# EAGLE design uLI-02 (EAGLE 7.2.0)
AUTHOR: M. Petrilak; VERSION: 00
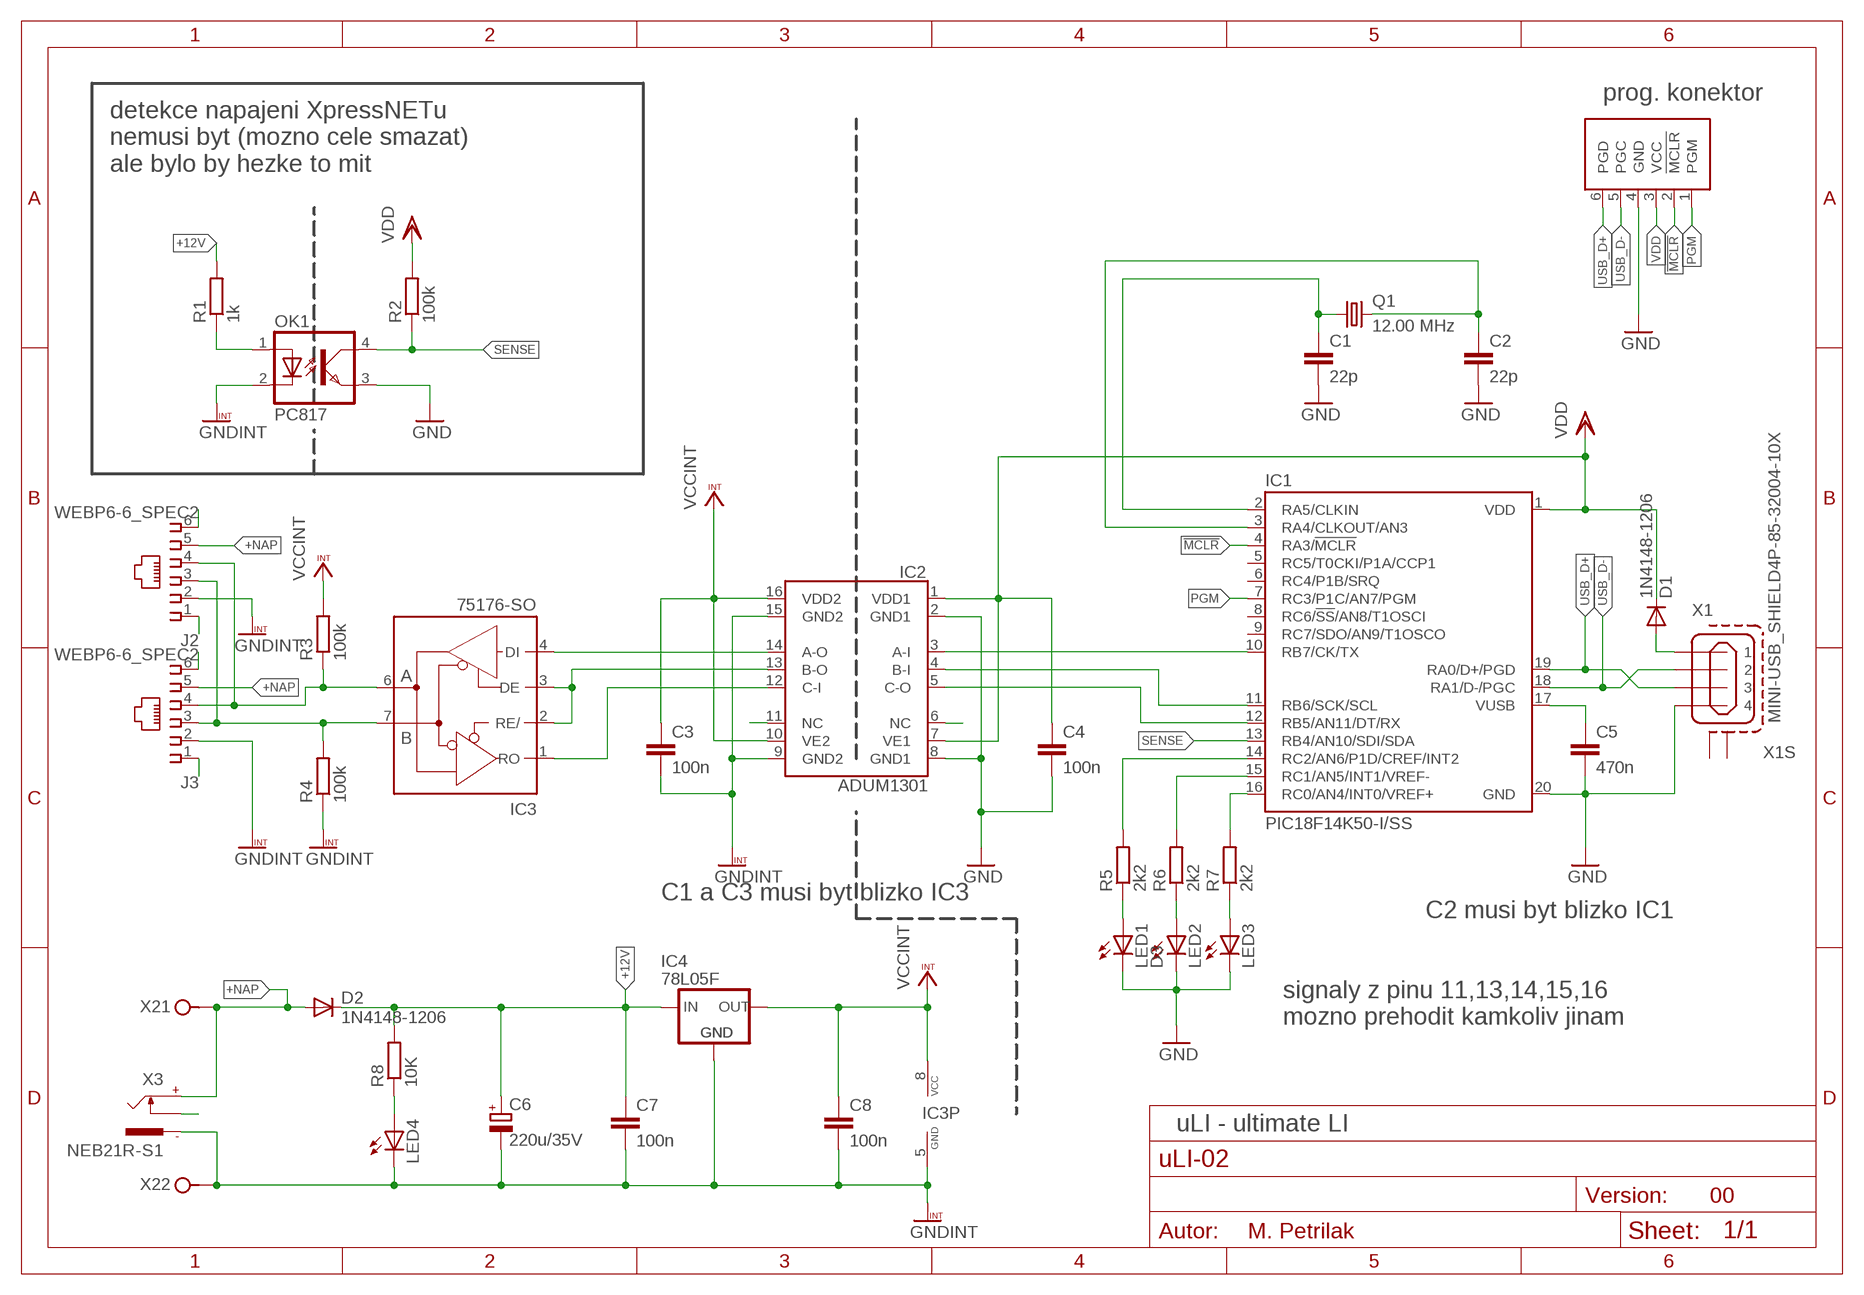
[diagram p0: schematic, sheet 1]

## Parts
C1  22p  C-EUC0805  [C0805]
C2  22p  C-EUC0805  [C0805]
C3  100n  C-EUC1206  [C1206]
C4  100n  C-EUC1206  [C1206]
C5  470n  C-EUC1206  [C1206]
C6  220u/35V  CPOL-EUE3.5-8L  [E3,5-8L]
C7  100n  C-EUC1206  [C1206]
C8  100n  C-EUC1206  [C1206]
D1  1N4148-1206  [D1206]
D2  1N4148-1206  [D1206]
IC1  PIC18F14K50-I/SS  [SSOP20]
IC2  ADUM1301  [SO-16W]
IC3  75176-SO  [SO08]
IC4  78L05F  [SOT89]
J1  PICPROG2-V  [6410-06-PICPROG]
J2  WEBP6-6_SPEC2  [WEBP6-6_SPEC2]
J3  WEBP6-6_SPEC2  [WEBP6-6_SPEC2]
LED1  D3  LED3MM  [LED3MM]
LED2  LED3MM  [LED3MM]
LED3  LED3MM  [LED3MM]
LED4  LED3MM  [LED3MM]
OK1  PC817  [DIL04]
Q1  12.00 MHz  XTAL  [HC49U70]
R1  1k  R-EU_R1206  [R1206]
R2  100k  R-EU_R1206  [R1206]
R3  100k  R-EU_R1206  [R1206]
R4  100k  R-EU_R1206  [R1206]
R5  2k2  R-EU_R1206  [R1206]
R6  2k2  R-EU_R1206  [R1206]
R7  2k2  R-EU_R1206  [R1206]
R8  10K  R-EU_R1206  [R1206]
X1  MINI-USB_SHIELD4P-85-32004-10X  [85-32004-10X]
X2  ARK1550/2_S  [ARK1550/2_SPEC]
X3  NEB21R-S1  [NEB21R_SPEC]

## Nets
!MCLR: IC1.4(RA3/!MCLR!) J1.2(!MCLR)
+12V [BUS]: C6.+ C7.1 D2.C IC4.3(VI) R1.2 R8.2
+NAP [BUS]: D2.A J2.5 J3.5 X2.1 X3.+
BUS_A [BUS]: IC3.6(A) J2.4 J3.4 R3.1
BUS_B [BUS]: IC3.7(B) J2.3 J3.3 R4.2
BUS_RX [BUS]: IC2.12(C-I) IC3.1(RO)
BUS_SENSE [BUS]: OK1.1(A) R1.1
BUS_TE [BUS]: IC2.13(B-O) IC3.2(RE/) IC3.3(DE)
BUS_TX [BUS]: IC2.14(A-O) IC3.4(DI)
GND: C1.2 C2.2 C4.2 C5.2 IC1.20(GND) IC2.2(GND1) IC2.8(GND1) J1.4(GND) LED1.K(C) LED2.K(C) LED3.K(C) OK1.3(EMIT) X1.4
GNDINT [BUS]: C3.2 C6.- C7.2 C8.2 IC2.9(GND2) IC2.15(GND2) IC3.5(GND) IC4.2(GND) IC4.2@1(GND) J2.2 J3.2 LED4.K(C) OK1.2(C) R4.1 X2.2 X3.-
LED1: IC1.14(RC2/AN6/P1D/CREF/INT2) R5.2
LED1_R: LED1.A R5.1
LED2: IC1.15(RC1/AN5/INT1/VREF-) R6.2
LED2_R: LED2.A R6.1
LED3: IC1.16(RC0/AN4/INT0/VREF+) R7.2
LED3_R: LED3.A R7.1
N$1 [BUS]: LED4.A R8.1
N$10: D1.A X1.1
N$19 [BUS]: J2.6
N$20 [BUS]: J2.1
N$24 [BUS]: J3.6
N$25 [BUS]: J3.1
NC1 [BUS]: X3.C
NC2 [BUS]: IC2.11(NC)
NC3: IC2.6(NC)
PGM: IC1.7(RC3/P1C/AN7/PGM) J1.1(PGM)
PROC_RX: IC1.12(RB5/AN11/DT/RX) IC2.5(C-O)
PROC_TE: IC1.11(RB6/SCK/SCL) IC2.4(B-I)
PROC_TX: IC1.10(RB7/CK/TX) IC2.3(A-I)
SENSE: IC1.13(RB4/AN10/SDI/SDA) OK1.4(COL) R2.1
USB_D+: IC1.19(RA0/D+/PGD) J1.6(PGD) X1.3
USB_D-: IC1.18(RA1/D-/PGC) J1.5(PGC) X1.2
VBUS: C5.1 IC1.17(VUSB)
VCCINT [BUS]: C3.1 C8.1 IC2.10(VE2) IC2.16(VDD2) IC3.8(VCC) IC4.1(VO) R3.2
VDD: C4.1 D1.C IC1.1(VDD) IC2.1(VDD1) IC2.7(VE1) J1.3(VCC) R2.2
XTAL1: C1.1 IC1.2(RA5/CLKIN) Q1.1
XTAL2: C2.1 IC1.3(RA4/CLKOUT/AN3) Q1.2
Unconnected: IC1.5(RC5/T0CKI/P1A/CCP1) IC1.6(RC4/P1B/SRQ) IC1.8(RC6/!SS!/AN8/T1OSCI) IC1.9(RC7/SDO/AN9/T1OSCO) X1.M1(S1) X1.M2(S2)

## Notes on the sheet
- prog. konektor
- detekce napajeni XpressNETu
  nemusi byt (mozno cele smazat)
  ale bylo by hezke to mit
- C1 a C3 musi byt blizko IC3
- C2 musi byt blizko IC1
- signaly z pinu 11,13,14,15,16
  mozno prehodit kamkoliv jinam
- uLI - ultimate LI

## Library data of the parts
C1-C5 C7 C8 = rcl:C-EU: CAPACITOR, European symbol
C6 = rcl:CPOL-EU: POLARIZED CAPACITOR, European symbol
D1 D2 = diode:1N4148: DIODE high speed (Philips)
IC1 = microchip:PIC18*K50: PIC with USB
IC2 = my:ADUM1301
IC3 = maxim:75176
IC4 = linear:78L*: POSITOIV-VOLTAGE REGULATORS Output up to 100 mA Source: http://focus.ti.com/lit/ds/symlink/ua78l05.pdf
J1 = con-molex:PICPROG2
J2 J3 = con-malina:WEBP6-6
LED1-LED4 = led:LED: LED OSRAM: - CHIPLED LG R971, LG N971, LY N971, LG Q971, LY Q971, LO R971, LY R971 LH N974, LH R974 LS Q976, LO Q976, LY Q976 LO Q996 - Hyper CHIPLED LW Q18S LB Q993, LB Q99A, LB R99A - SideLED LS A670, LO A670, LY A670, LG A670, LP A670 LB A673, LV A673, LT A673, LW A673 LH A674 LY A675 LS A676, LA A676, LO A676, LY A676, LW A676 LS A679, LY A679, LG A679 - Hyper Micro SIDELED® LS Y876, LA Y876, LO Y876, LY Y876 LT Y87S - SmartLED LW L88C, LW L88S LB L89C, LB L89S, LG L890 LS L89K, LO L89K, LY L89K LS L896, LA L896, LO L896, LY L896 - TOPLED LS T670, LO T670, LY T670, LG T670, LP T670 LSG T670, LSP T670, LSY T670, LOP T670, LYG T670 LG T671, LOG T671, LSG T671 LB T673, LV T673, LT T673, LW T673 LH T674 LS T676, LA T676, LO T676, LY T676, LB T676, LH T676, LSB T676, LW T676 LB T67C, LV T67C, LT T67C, LS T67K, LO T67K, LY T67K, LW E67C LS E67B, LA E67B, LO E67B, LY E67B, LB E67C, LV E67C, LT E67C LW T67C LS T679, LY T679, LG T679 LS T770, LO T770, LY T770, LG T770, LP T770 LB T773, LV T773, LT T773, LW T773 LH T774 LS E675, LA E675, LY E675, LS T675 LS T776, LA T776, LO T776, LY T776, LB T776 LHGB T686 LT T68C, LB T68C - Hyper Mini TOPLED® LB M676 - Mini TOPLED Santana® LG M470 LS M47K, LO M47K, LY M47K Source: http://www.osram.convergy.de LUXEON: - LUMILED® LXK2-PW12-R00, LXK2-PW12-S00, LXK2-PW14-U00, LXK2-PW14-V00 LXK2-PM12-R00, LXK2-PM12-S00, LXK2-PM14-U00 LXK2-PE12-Q00, LXK2-PE12-R00, LXK2-PE12-S00, LXK2-PE14-T00, LXK2-PE14-U00 LXK2-PB12-K00, LXK2-PB12-L00, LXK2-PB12-M00, LXK2-PB14-N00, LXK2-PB14-P00, LXK2-PB14-Q00 LXK2-PR12-L00, LXK2-PR12-M00, LXK2-PR14-Q00, LXK2-PR14-R00 LXK2-PD12-Q00, LXK2-PD12-R00, LXK2-PD12-S00 LXK2-PH12-R00, LXK2-PH12-S00 LXK2-PL12-P00, LXK2-PL12-Q00, LXK2-PL12-R00 Source: www.luxeon.com KINGBRIGHT: KA-3528ASYC Source: www.kingbright.com
OK1 = optocoupler:PC817: SHARP OPTO COUPLER
Q1 = crystal:XTAL
R1-R8 = rcl:R-EU_: RESISTOR, European symbol
X1 = con-cypressindustries:MINI-USB_SHIELD4P-: MINI USB 4 Pol. Source: www.cypressindustries.com
X2 = con-malina:ARK1550/2
X3 = con-lumberg:NEB21R: Klinkeneinbaukupplung

## Net classes
0 default: width 0.3 mm
1 BUS: clearance 3 mm to class 0

## Board
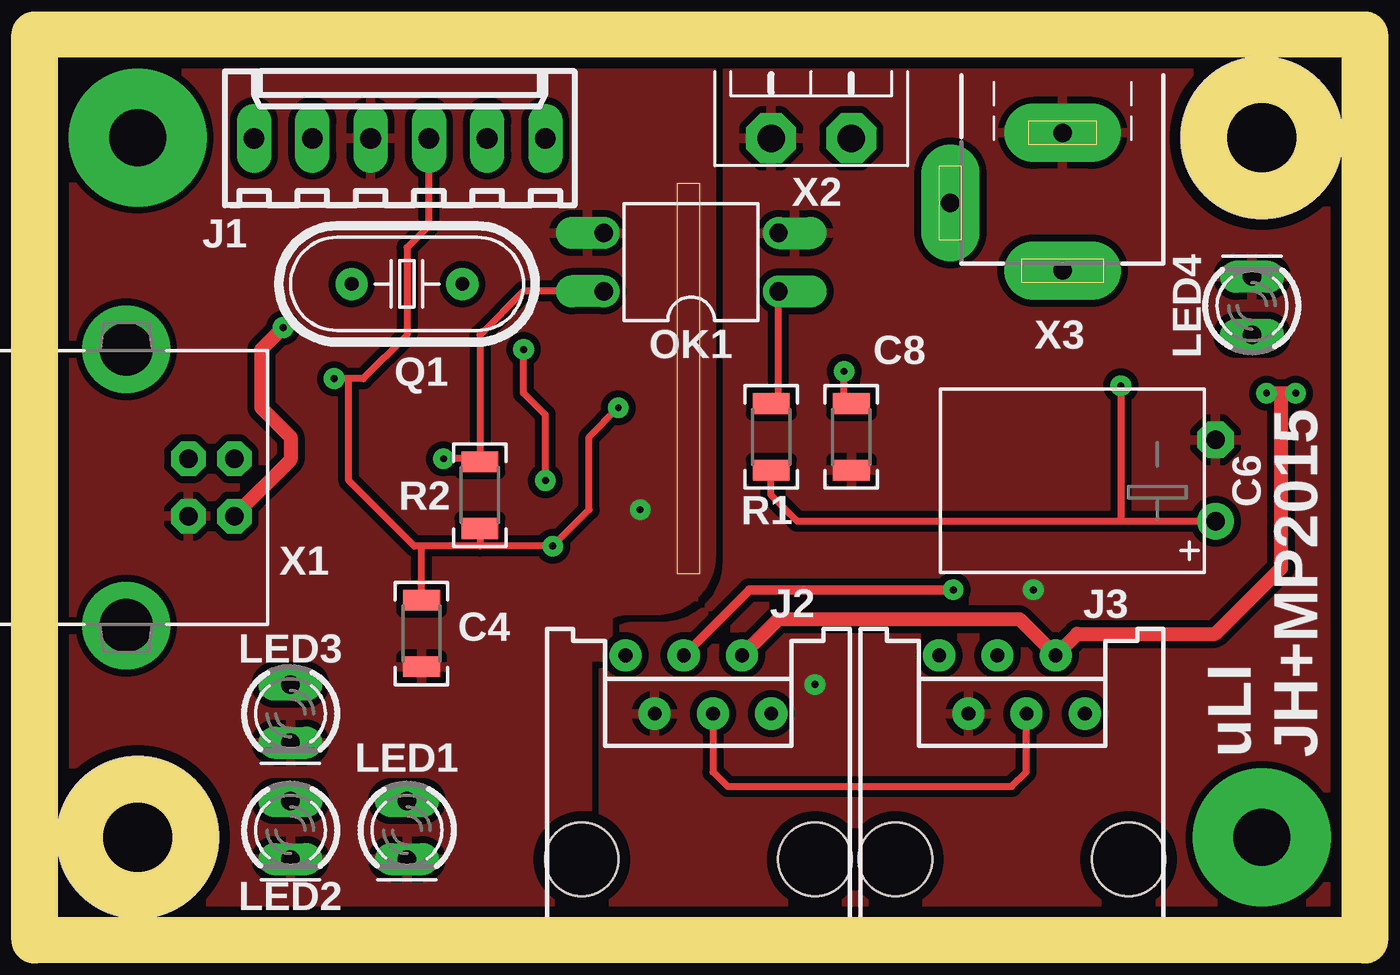
[diagram p1: board, top side]
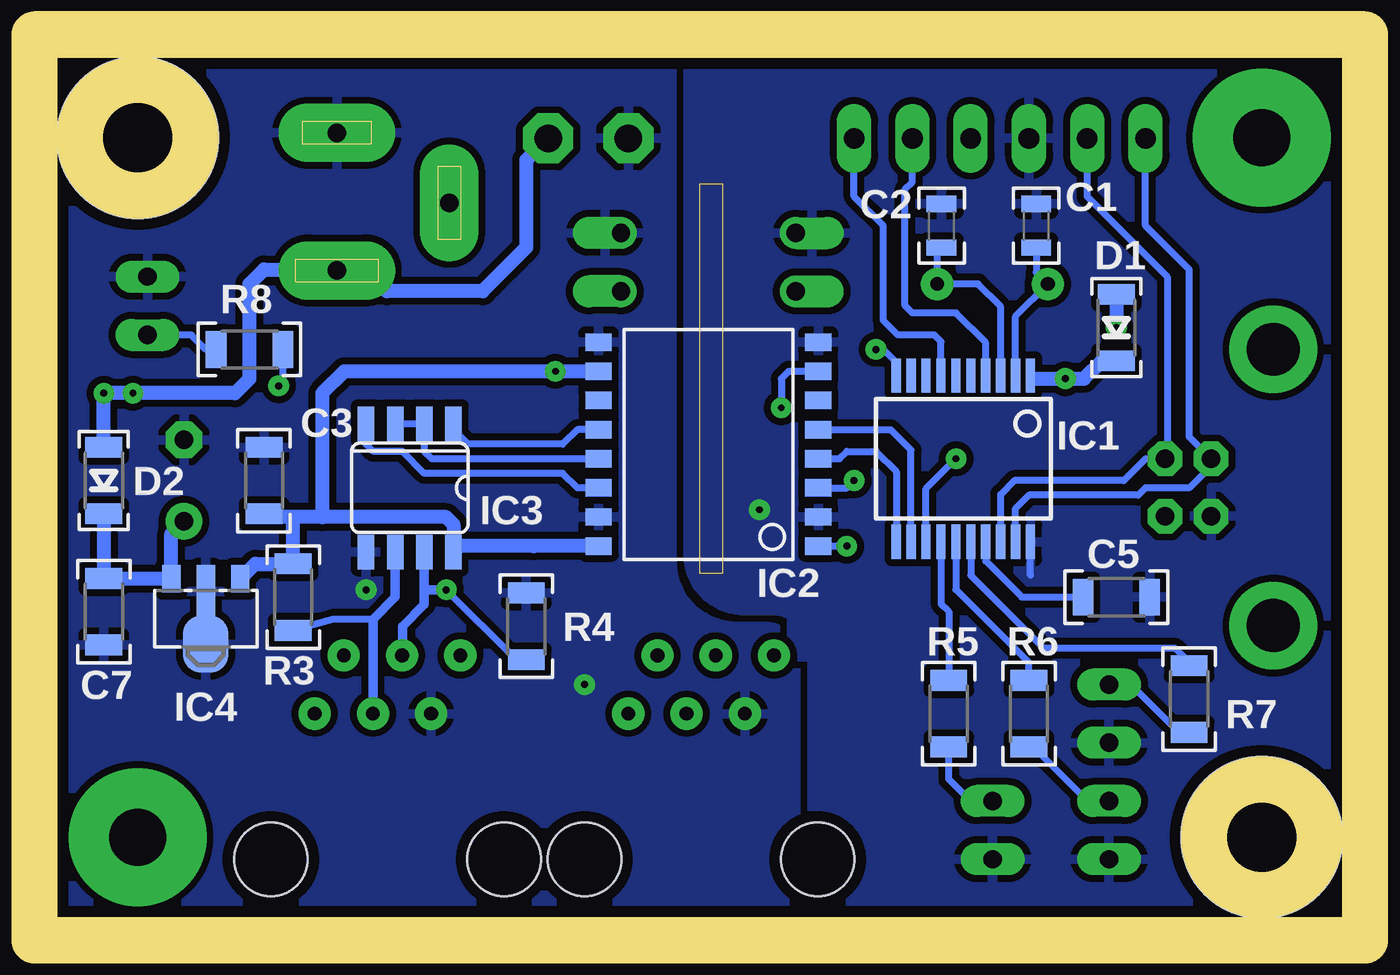
[diagram p2: board, bottom side, seen from below]

Size 56 x 37.5 mm. Coordinates in mm from the lower left corner, seen from the top.
Outline: 0,0 56,0 56,37.5 0,37.5 0,0
Copper layers (1*16): Top 0.04mm / dielectric 1.5mm / Bottom 0.04mm
Design rules "cina_navrh": minimum track width 0.2mm, minimum drill 0.3mm, track to track 0.3mm, track to pad 0.3mm, pad to pad 0.3mm, via to via 0.3mm, smd to smd 0mil, copper to edge 0.5mm, drill to drill 0.5mm, minimum pad ring 0.3mm, minimum via ring 0.3mm, stop-mask expansion 0.1mm, vias tented up to drill 0.8mm, thermal gap 0.3mm
Holes 7 mm at 3.5,3.5 52.5,34
Milling: area 1,1 to 6,6; area 50,31.5 to 55,36.5; 8 lines

### Footprints (pad centres in the part's own frame; a part is rotated, then mirrored left to right if it is on the bottom)
C0805 = smd 0.7 x 1.3: 1 -0.95,0; 2 0.95,0
C1206 = smd 0.9 x 1.6: 1 -1.45,0; 2 1.45,0
E3,5-8L = drill 0.813 pad 1.6: + -1.778,0 | drill 0.813 pad 1.6 octagon: - 1.778,0
D1206 = smd 0.9 x 1.6: A -1.45,0; C 1.45,0
SSOP20 = smd 0.4 x 1.5: 1 -2.925,-3.625; 2 -2.275,-3.625; 3 -1.625,-3.625; 4 -0.975,-3.625; 5 -0.325,-3.625; 6 0.325,-3.625; 7 0.975,-3.625; 8 1.625,-3.625; 9 2.275,-3.625; 10 2.925,-3.625; 11 2.925,3.625; 12 2.275,3.625; 13 1.625,3.625; 14 0.975,3.625; 15 0.325,3.625; 16 -0.325,3.625; 17 -0.975,3.625; 18 -1.625,3.625; 19 -2.275,3.625; 20 -2.925,3.625
SO-16W = smd 0.762 x 1.143: 1 -5.08,-4.788; 2 -3.81,-4.788; 3 -2.54,-4.788; 4 -1.27,-4.788; 5 0,-4.788; 6 1.27,-4.788; 7 2.54,-4.788; 8 3.81,-4.788; 9 3.81,4.788; 10 2.54,4.788; 11 1.27,4.788; 12 0,4.788; 13 -1.27,4.788; 14 -2.54,4.788; 15 -3.81,4.788; 16 -5.08,4.788
SO08 = smd 0.72 x 1.5: 1 -1.905,-2.8; 2 -0.635,-2.8; 3 0.635,-2.8; 4 1.905,-2.8; 5 1.905,2.8; 6 0.635,2.8; 7 -0.635,2.8; 8 -1.905,2.8
SOT89 = smd 0.8 x 1.2: 1 -1.5,-1.75; 3 1.499,-1.75 | smd 0.8 x 2.3: 2 0,-1.2 | smd 2 x 2.5: 2@1 0,1.1
6410-06-PICPROG = drill 0.9 long: 1 6.35,0; 2 3.81,0; 3 1.27,0; 4 -1.27,0; 5 -3.81,0; 6 -6.35,0
WEBP6-6_SPEC2 = drill 0.6 pad 1.4: 1 -3.175,8.89; 2 -1.905,6.35; 3 -0.635,8.89; 4 0.635,6.35; 5 1.905,8.89; 6 3.175,6.35 | hole 3.2: -5.08,0; 5.08,0
LED3MM = drill 0.8 pad 1.4 long: A -1.27,0; K 1.27,0
DIL04 = drill 0.8 pad 1.4 offset: 1 -1.27,-3.81; 2 1.27,-3.81; 3 1.27,3.81; 4 -1.27,3.81
HC49U70 = drill 0.6 pad 1.4: 1 -2.413,0; 2 2.413,0
R1206 = smd 0.9 x 1.6: 1 -1.45,0; 2 1.45,0
85-32004-10X = drill 0.8 pad 1.5 octagon: 1 4.71,-1.25; 2 4.71,1.25; 3 2.71,1.25; 4 2.71,-1.25 | drill 2.3 pad 3: M1 0,6.02; M2 0,-6.02
ARK1550/2_SPEC = drill 1.2 pad 2.184 octagon: 1 0,0; 2 3.5,0
NEB21R_SPEC = drill 0.8 pad 2.54 long: + 0,7.35; - 0,1.35; C 4.9,4.4

### Placement (x,y rotation side)
C1  13.34,30.16 90 bottom
C2  17.46,30.16 90 bottom
C3  46.99,19.05 90 bottom
C4  15.88,12.38 270 top
C5  9.84,13.97 0 bottom
C6  50.48,19.05 90 top
C7  53.98,13.34 270 bottom
C8  34.61,20.95 270 top
D1  9.84,25.72 270 bottom
D2  53.98,19.05 270 bottom
IC1  16.51,20 180 bottom
IC2  27.62,21.27 90 bottom
IC3  40.64,18.73 180 bottom
IC4  49.53,13.02 180 bottom
J1  14.92,33.97 0 top
J2  27.94,2.54 0 top
J3  41.61,2.54 0 top
LED1  15.24,3.81 270 top
LED2  10.16,3.81 270 top
LED3  10.16,8.89 270 top
LED4  52.07,26.67 90 top
OK1  27.62,28.57 90 top
Q1  15.24,27.62 0 top
R1  31.11,20.95 270 top
R2  18.41,18.41 270 top
R3  45.72,13.97 90 bottom
R4  35.56,12.7 270 bottom
R5  17.14,8.89 90 bottom
R6  13.65,8.89 90 bottom
R7  6.67,9.53 90 bottom
R8  47.62,24.77 0 bottom
X1  3,18.75 0 top
X2  34.61,33.97 180 top
X3  43.81,35.56 180 top

### Tracks (layer width: path | path; a pad name or v marks a point on that pad's centre or on a via)
!MCLR
  Bottom 0.305: IC1.4 15.54,25.06 16.83,26.35 18.73,26.35 19.05,26.67 19.05,31.75 18.73,32.07 J1.2
+12V  (via drill 0.3)
  Top 0.305: C6.+ 46.35,17.27 | 46.35,17.27 32.26,17.27 31.11,18.41 R1.2 | v46.35,23.18 46.35,17.27
  Bottom 0.305: C6.+ 50.48,17.46 | R8.2 46.17,23.36 v46.35,23.18
  Bottom 0.61: D2.C C7.1 51.05,14.79 IC4.3 51.03,16.73 C6.+
+NAP  (via drill 0.3)
  Top 0.61: J2.5 31.43,13.02 41.93,13.02 J3.5 44.45,12.37 50.47,12.37 53.34,15.24 53.34,22.86 | 53.34,22.86 v53.98,22.86 | v52.7,22.86 53.34,22.86
  Bottom 0.61: D2.A v53.98,22.86 v52.7,22.86 48.26,22.86 47.62,23.5 47.62,27.62 46.99,28.26 44.5,28.26 X3.+ 41.64,27.3 37.47,27.3 35.56,29.21 35.56,33.02 X2.1
BUS_A
  Top 0.305: J2.4 28.57,6.35 29.21,5.71 41.59,5.71 42.23,6.35 42.23,8.87
  Top 0.406: 42.23,8.87 J3.4
  Bottom 0.305: 42.24,13 43.97,13 R3.1
  Bottom 0.406: IC3.6 41.27,13.97 42.24,13 J3.4
BUS_B  (via drill 0.3)
  Top 0.406: J2.3 30.16,14.29 v39.05,14.29
  Bottom 0.305: R4.2 36.02,11.25 v39.05,14.29
  Bottom 0.406: J3.3 40.96,11.45 40.96,12.7 40.01,13.65 40.01,14.29 | IC3.7 40.01,14.29 | v39.05,14.29 40.01,14.29
BUS_RX
  Bottom 0.305: IC2.12 33.34,21.27 33.97,20.64 38.1,20.64 38.73,21.27 IC3.1
BUS_SENSE
  Top 0.305: R1.1 31.43,22.72 OK1.1
BUS_TE
  Bottom 0.305: IC3.3 IC3.2 40.01,20.32 39.69,20 IC2.13
BUS_TX
  Bottom 0.305: IC2.14 33.34,18.73 33.97,19.37 40.01,19.37 40.96,20.32 42.23,20.32 42.55,20.64 IC3.4
GND  (via drill 0.3)
  Bottom 0.305: IC1.20 | 13.59,14.92 13.59,15.88
  other vias: 25.4,17.78
  pour Top (isolate 0.254, rank 6): 0,0 56,0 56,37.5 0,37.5
  pour Bottom (isolate 0.254, rank 6): 0,0 56,0 56,37.5 0,37.5
GNDINT  (via drill 0.3)
  other vias: 42.55,14.29 33.02,10.16
  pour Top (isolate 0.305): 29.21,37.5 56,37.5 56,0 23.81,0 23.81,11.39 arc-90 25.12,12.7 26.37,12.7 arc90 29.21,15.54
  pour Bottom (isolate 0.254, rank 2): 29.21,37.5 56,37.5 56,0 23.81,0.32 23.81,11.39 arc-90 25.12,12.7 26.37,12.7 arc90 29.21,15.54
LED1
  Bottom 0.305: IC1.14 17.48,13.68 17.14,13.34 R5.2
LED1_R
  Bottom 0.305: LED1.A 16.19,5.08 17.14,6.03 R5.1
LED2
  Bottom 0.305: R6.2 13.65,11.11 16.84,14.29 IC1.15
LED2_R
  Bottom 0.305: R6.1 13.34,7.3 11.11,5.08 LED2.A
LED3
  Bottom 0.305: IC1.16 16.18,14.91 13.02,11.75 7.3,11.75 6.67,11.11 R7.2
LED3_R
  Bottom 0.305: LED3.A 9.21,10.16 7.12,8.07 R7.1
N$1
  Bottom 0.305: R8.1 49.53,24.77 50.16,25.4 LED4.A
N$9  (via drill 2.5 pad 6)
  other vias: 3.5,34
N$10  (via drill 0.3)
  Top 0.61: v9.84,25.72 8.89,24.77 8.89,22.23 10.16,20.95 10.16,19.95 X1.1
  Bottom 0.61: D1.A v9.84,25.72
N$18  (via drill 2.5 pad 6)
  other vias: 52.5,3.5
PGM
  Bottom 0.305: IC1.7 17.48,25.11 17.78,25.4 19.37,25.4 20,26.04 20,30.16 21.27,31.43 J1.1
PROC_RX
  Bottom 0.305: IC1.12 18.79,20.37 19.68,21.27 IC2.5
PROC_TE
  Bottom 0.305: IC1.11 19.43,19.43 20.32,20.32 21.59,20.32 21.91,20 IC2.4
PROC_TX  (via drill 0.3)
  Top 0.305: v21.27,19.05 21.27,21.91 20.32,22.86 v20.32,24.77
  Bottom 0.305: IC1.10 19.43,24.2 20,24.77 v20.32,24.77 | IC2.3 21.59,18.73 v21.27,19.05
SENSE  (via drill 0.3)
  Top 0.305: OK1.4 20.32,27.3 18.41,25.4 R2.1 18.28,20 v16.83,20
  Bottom 0.305: IC1.13 18.14,18.7 v16.83,20
USB_D+
  Bottom 0.305: IC1.19 14.23,17.83 13.65,18.41 8.89,18.41 8.57,18.73 6.67,18.73 5.71,19.69 X1.3 6.67,20.96 6.67,28.26 8.57,30.16 J1.6
USB_D-
  Bottom 0.305: IC1.18 14.88,18.45 14.29,19.05 9.53,19.05 8.57,20 X1.2 | 7.62,20.09 7.62,27.94 11.11,31.43 J1.5
  Bottom 0.406: 7.62,20.09 X1.2
VBUS
  Bottom 0.305: IC1.17 15.54,15.54 13.97,13.97 C5.1
VCCINT  (via drill 0.3)
  Top 0.305: C8.1 34.29,22.72 v34.29,23.81
  Bottom 0.305: 35.19,16.14 35.24,16.19
  Bottom 0.61: IC2.10 v34.29,23.81 43.5,23.81 44.45,22.86 44.45,17.46 | IC2.16 35.24,16.19 38.48,16.19 IC3.8 38.73,17.14 39.05,17.46 44.45,17.46 | 44.45,17.46 45.72,17.46 | 45.72,17.46 46.85,17.46 C3.1 | 45.72,17.46 R3.2 47.38,15.42 IC4.1
VDD  (via drill 0.3)
  Top 0.305: 12.7,23.5 13.34,23.5 15.24,25.4 15.24,29.21 16.19,30.16 J1.3 | 12.7,23.5 v12.06,23.5 | 12.7,23.5 12.7,19.05 15.56,16.19 15.88,16.19 | 18.41,16.19 v21.59,16.19 23.18,17.78 23.18,20.95 v24.45,22.23 | 18.41,16.19 15.88,16.19 | R2.2 18.41,16.19 | C4.1 15.88,16.19
  Bottom 0.305: IC1.1 13.45,23.5 | IC2.1 v21.59,16.19 | IC2.7 24.13,23.81 24.45,23.5 v24.45,22.23
  Bottom 0.61: 13.45,23.5 v12.06,23.5 11.25,23.5 10.48,24.27 D1.C
XTAL1
  Bottom 0.305: IC1.2 14.23,26.21 Q1.1 13.34,28.13 C1.1
XTAL2
  Bottom 0.305: IC1.3 14.88,26.63 15.88,27.62 Q1.2 17.65,29.02 C2.1

### Text on the board
tNames: uLI / JH+MP2015